# Altium schematic sheet motor-driver.SchDoc
size A
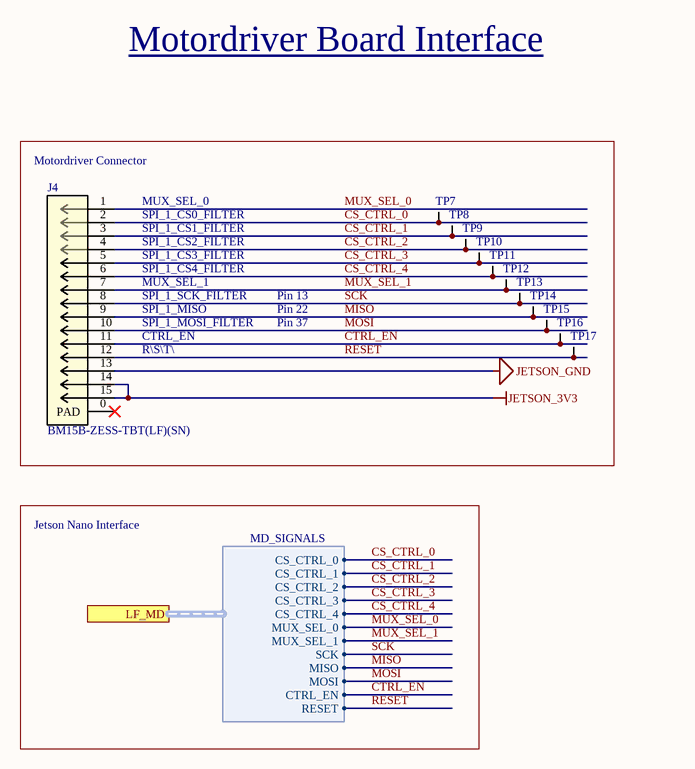
[diagram p0: motor-driver.SchDoc]

## Parts
J4  BM15B-ZESS-TBT(LF)(SN)  [JST ZE SMT 15POS]
TP7  Test Point (Via)  [TP]  (value not drawn)  (no BOM)
TP8  Test Point (Via)  [TP]  (value not drawn)  (no BOM)
TP9  Test Point (Via)  [TP]  (value not drawn)  (no BOM)
TP10  Test Point (Via)  [TP]  (value not drawn)  (no BOM)
TP11  Test Point (Via)  [TP]  (value not drawn)  (no BOM)
TP12  Test Point (Via)  [TP]  (value not drawn)  (no BOM)
TP13  Test Point (Via)  [TP]  (value not drawn)  (no BOM)
TP14  Test Point (Via)  [TP]  (value not drawn)  (no BOM)
TP15  Test Point (Via)  [TP]  (value not drawn)  (no BOM)
TP16  Test Point (Via)  [TP]  (value not drawn)  (no BOM)
TP17  Test Point (Via)  [TP]  (value not drawn)  (no BOM)

## Ports
LF_MD (harness MD_SIGNALS)

## Harnesses
MD_SIGNALS: CS_CTRL_0, MUX_SEL_1, SCK, MOSI, MISO, CS_CTRL_1, CS_CTRL_2, CS_CTRL_3, CS_CTRL_4, MUX_SEL_0, CTRL_EN, RESET

## Nets
JETSON_3V3: J4.14 J4.15
JETSON_GND: J4.13
CS_CTRL_0: J4.2 TP7.1 ; port LF_MD.CS_CTRL_0
CS_CTRL_1: J4.3 TP8.1 ; port LF_MD.CS_CTRL_1
CS_CTRL_2: J4.4 TP9.1 ; port LF_MD.CS_CTRL_2
CS_CTRL_3: J4.5 TP10.1 ; port LF_MD.CS_CTRL_3
CS_CTRL_4: J4.6 TP11.1 ; port LF_MD.CS_CTRL_4
CTRL_EN: J4.11 TP16.1 ; port LF_MD.CTRL_EN
MISO: J4.9 TP14.1 ; port LF_MD.MISO
MOSI: J4.10 TP15.1 ; port LF_MD.MOSI
MUX_SEL_0: J4.1 ; port LF_MD.MUX_SEL_0
MUX_SEL_1: J4.7 TP12.1 ; port LF_MD.MUX_SEL_1
RESET: J4.12 TP17.1 ; port LF_MD.RESET
SCK: J4.8 TP13.1 ; port LF_MD.SCK

Not connected (* = marked no-connect by the designer): J4 0(PAD)*

## Notes on the sheet
- Motordriver Board Interface
- (near J4) Motordriver Connector
- MUX_SEL_0
- SPI_1_CS0_FILTER
- SPI_1_CS1_FILTER
- SPI_1_CS2_FILTER
- SPI_1_CS3_FILTER
- SPI_1_CS4_FILTER
- CTRL_EN
- SPI_1_SCK_FILTER
- SPI_1_MISO
- SPI_1_MOSI_FILTER
- MUX_SEL_1
- Pin 37
- Pin 22
- Pin 13
- R\S\T\
- Jetson Nano Interface

## Library data of the parts
J4 = CN 15POS JST ZE SMT: CONN HEADER VERT SMD 15POS ZE; Supplier 1: Digi-Key; Supplier Part Number 1: 455-4211-1-ND; Part Number: CN 15POS JST ZE SMT; Manufacturer Part Number 1: BM15B-ZESS-TBT(LF)(SN); Supplier URL 1: https://www.digikey.ca/en/products/detail/jst-sales-america-inc/BM15B-ZESS-TBT-LF-SN/1886999?s=N4IgTCBcDaIEIFkCMBWOBaAWgUQMq-QBU5CAKAGQDEBKU3AOWpAF0BfIA; Pin Count: 15
TP7-TP17 = Test Point (Via): Part Number: Test Point (Via)